# Altium schematic sheet LNA_BFU550.SchDoc: Low Noise Amplifier
size A4; Author: Almela; Revision: 1.2; SheetNumber: 5; SheetTotal: 7
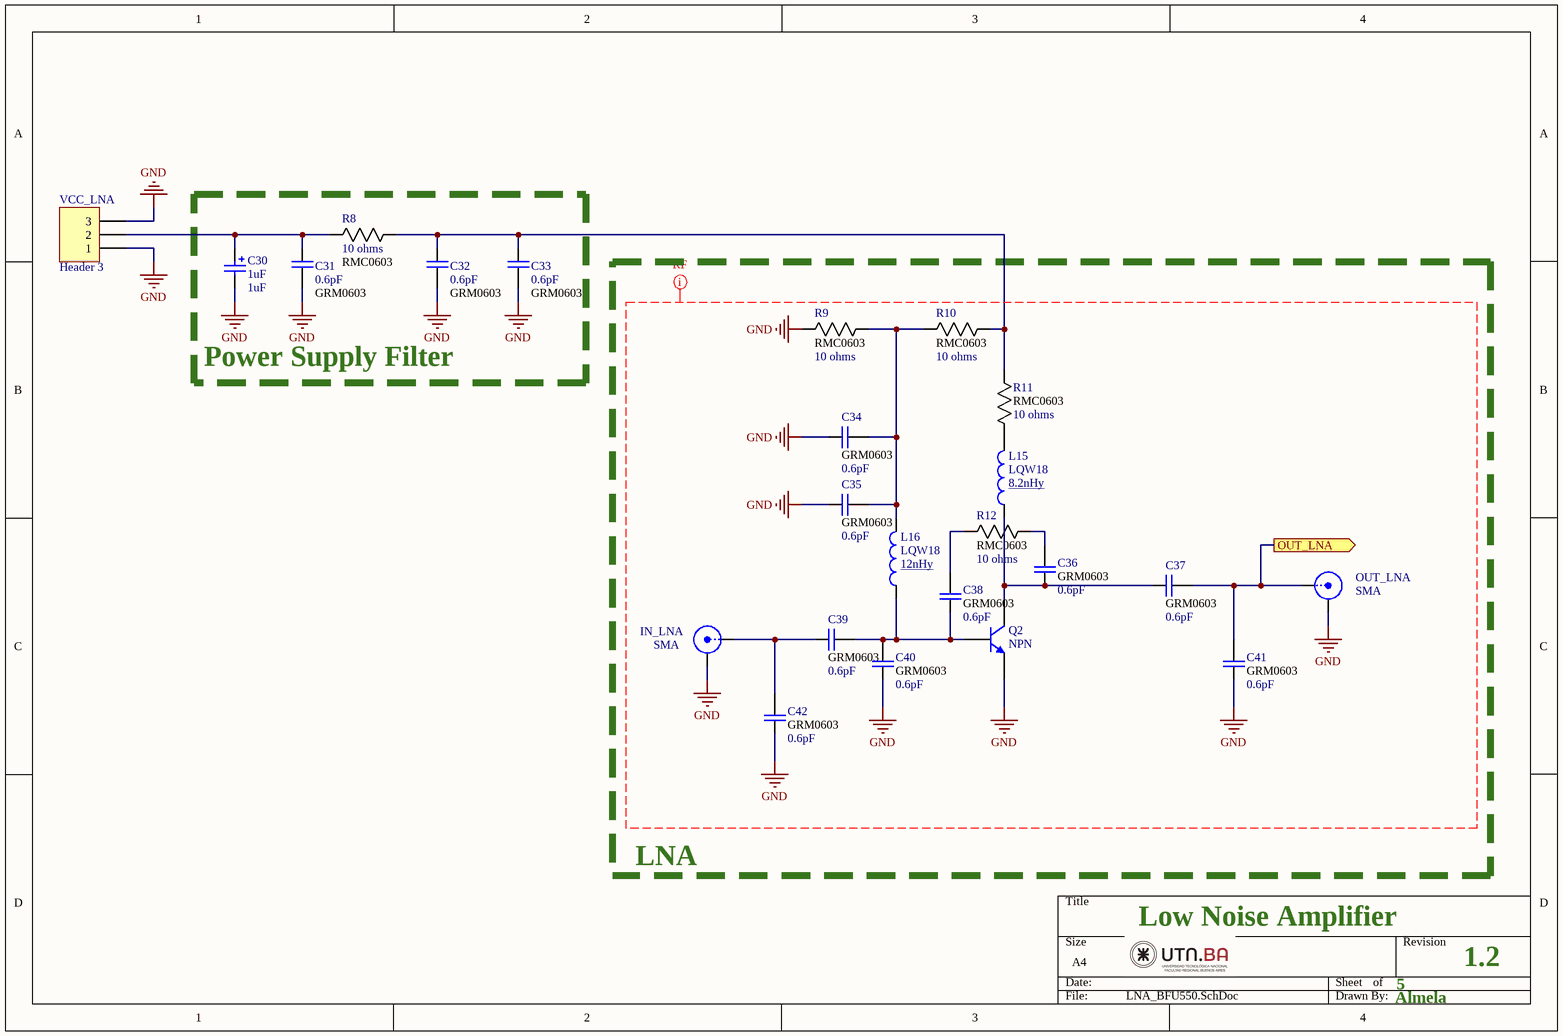
[diagram p0: LNA_BFU550.SchDoc]

## Parts
C30  1uF  [6-0805_N]
C31  value 0.6pF  footprint: GRM0603  [CAPC1608X90N]  (hidden comment: Cap 0603)
C32  value 0.6pF  footprint: GRM0603  [CAPC1608X90N]  (hidden comment: Cap 0603)
C33  value 0.6pF  footprint: GRM0603  [CAPC1608X90N]  (hidden comment: Cap 0603)
C34  value 0.6pF  footprint: GRM0603  [CAPC1608X90N]  (hidden comment: Cap 0603)
C35  value 0.6pF  footprint: GRM0603  [CAPC1608X90N]  (hidden comment: Cap 0603)
C36  value 0.6pF  footprint: GRM0603  [CAPC1608X90N]  (hidden comment: Cap 0603)
C37  value 0.6pF  footprint: GRM0603  [CAPC1608X90N]  (hidden comment: Cap 0603)
C38  value 0.6pF  footprint: GRM0603  [CAPC1608X90N]  (hidden comment: Cap 0603)
C39  value 0.6pF  footprint: GRM0603  [CAPC1608X90N]  (hidden comment: Cap 0603)
C40  value 0.6pF  footprint: GRM0603  [CAPC1608X90N]  (hidden comment: Cap 0603)
C41  value 0.6pF  footprint: GRM0603  [CAPC1608X90N]  (hidden comment: Cap 0603)
C42  value 0.6pF  footprint: GRM0603  [CAPC1608X90N]  (hidden comment: Cap 0603)
IN_LNA  SMA  [SMA-142-0701-851]
L15  LQW18  value 8.2nHy  [INDC1608X100N]
L16  LQW18  value 12nHy  [INDC1608X100N]
OUT_LNA  SMA  [SMA-142-0701-851]
Q2  NPN  [SOT23_N_bfu550a]
R8  value 10 ohms  footprint: RMC0603  [RESC1508X55N]  (hidden comment: Resistor)
R9  value 10 ohms  footprint: RMC0603  [RESC1508X55N]  (hidden comment: Resistor)
R10  value 10 ohms  footprint: RMC0603  [RESC1508X55N]  (hidden comment: Resistor)
R11  value 10 ohms  footprint: RMC0603  [RESC1508X55N]  (hidden comment: Resistor)
R12  value 10 ohms  footprint: RMC0603  [RESC1508X55N]  (hidden comment: Resistor)
VCC_LNA  Header 3  [HDR1X3]

## Blocks framed on the sheet
Power Supply Filter: C30-C33 R8

## Ports
OUT_LNA (out)

## Nets
GND: C30.2 C31.2 C32.2 C33.2 C34.1 C35.1 C40.1 C41.1 C42.1 IN_LNA.2(Y) OUT_LNA.2(Y) Q2.2(E) R9.2 VCC_LNA.1 VCC_LNA.3
OUT_LNA: C37.2 C41.2 OUT_LNA.1(X) ; port OUT_LNA
NetC30_1: C30.1 C31.1 R8.2 VCC_LNA.2
NetC32_1: C32.1 C33.1 R8.1 R10.2 R11.2
NetC34_2: C34.2 C35.2 L16.2 R9.1 R10.1
NetC36_1: C36.1 C37.1 L15.1 Q2.3(C)
NetC36_2: C36.2 R12.2
NetC38_1: C38.1 C39.2 C40.2 L16.1 Q2.1(B)
NetC38_2: C38.2 R12.1
NetC39_1: C39.1 C42.2 IN_LNA.1(X)
NetL15_2: L15.2 R11.1

## Layout directives
net class RF50R: GND

## Notes on the sheet
- LNA

## Library data of the parts
C30 = Cap Pol2_1: Polarized Capacitor (Axial); Published: 8-Jun-2000; LatestRevisionDate: 17-Jul-2002; LatestRevisionNote: Re-released for DXP Platform.; PackageReference: POLAR0.8; Publisher: Altium Limited; PackageDescription: Polarized Capacitor; 2 Leads; Value: 1uF
C31-C42 = Cap: Capacitor GRM18 0603; Published: 8-Jun-2000; LatestRevisionDate: 17-Jul-2002; LatestRevisionNote: Re-released for DXP Platform.; PackageReference: POLAR0.8; Publisher: Altium Limited; PackageDescription: Polarized Capacitor; 2 Leads; Supplier 1: Mouser
IN_LNA OUT_LNA = SMB: SMB Straight Connector; LatestRevisionDate: 17-Jul-2002; LatestRevisionNote: Re-released for DXP Platform.; Publisher: Altium Limited
L15 L16 = LQW18_1: Inductor LQW Package: 0603 (1608); MP: LQW18ANR47J00D; MF: Murata; Arrow_Electronics-Purchase-URL: https://snapeda.com/shop?store=Arrow+Electronics&id=1501811; Value: *; Availability: Good; Price: None; DigiKey-Purchase-URL: https://snapeda.com/shop?store=DigiKey&id=1501811; Package: 1608 Murata; SnapEDA_Link: https://www.snapeda.com/parts/LQW18ANR47J00D/Murata/view-part/1501811/?ref=snap; Mouser-Purchase-URL: https://snapeda.com/shop?store=Mouser&id=1501811
Q2 = BFU550A: NPN Bipolar Transistor; Published: 8-Jun-2000; LatestRevisionDate: 17-Jul-2002; LatestRevisionNote: Re-released for DXP Platform.; PackageReference: TO-226-AA; Publisher: Altium Limited; PackageDescription: TO, Flat Index; 3 In-Line, Axial Leads; Body Dia. 4.8mm; Leads 0.55 x 0.51 mm (max); Code_JEDEC: TO-226-AA
R8-R12 = Resistor: Resistor RMC0603; Mfr_Name: Stackpole International
VCC_LNA = Header 3: Header, 3-Pin; LatestRevisionDate: 17-Jul-2002; LatestRevisionNote: Re-released for DXP Platform.; Publisher: Altium Limited